# Altium project ErrorCodeDisplay.PrjPcb
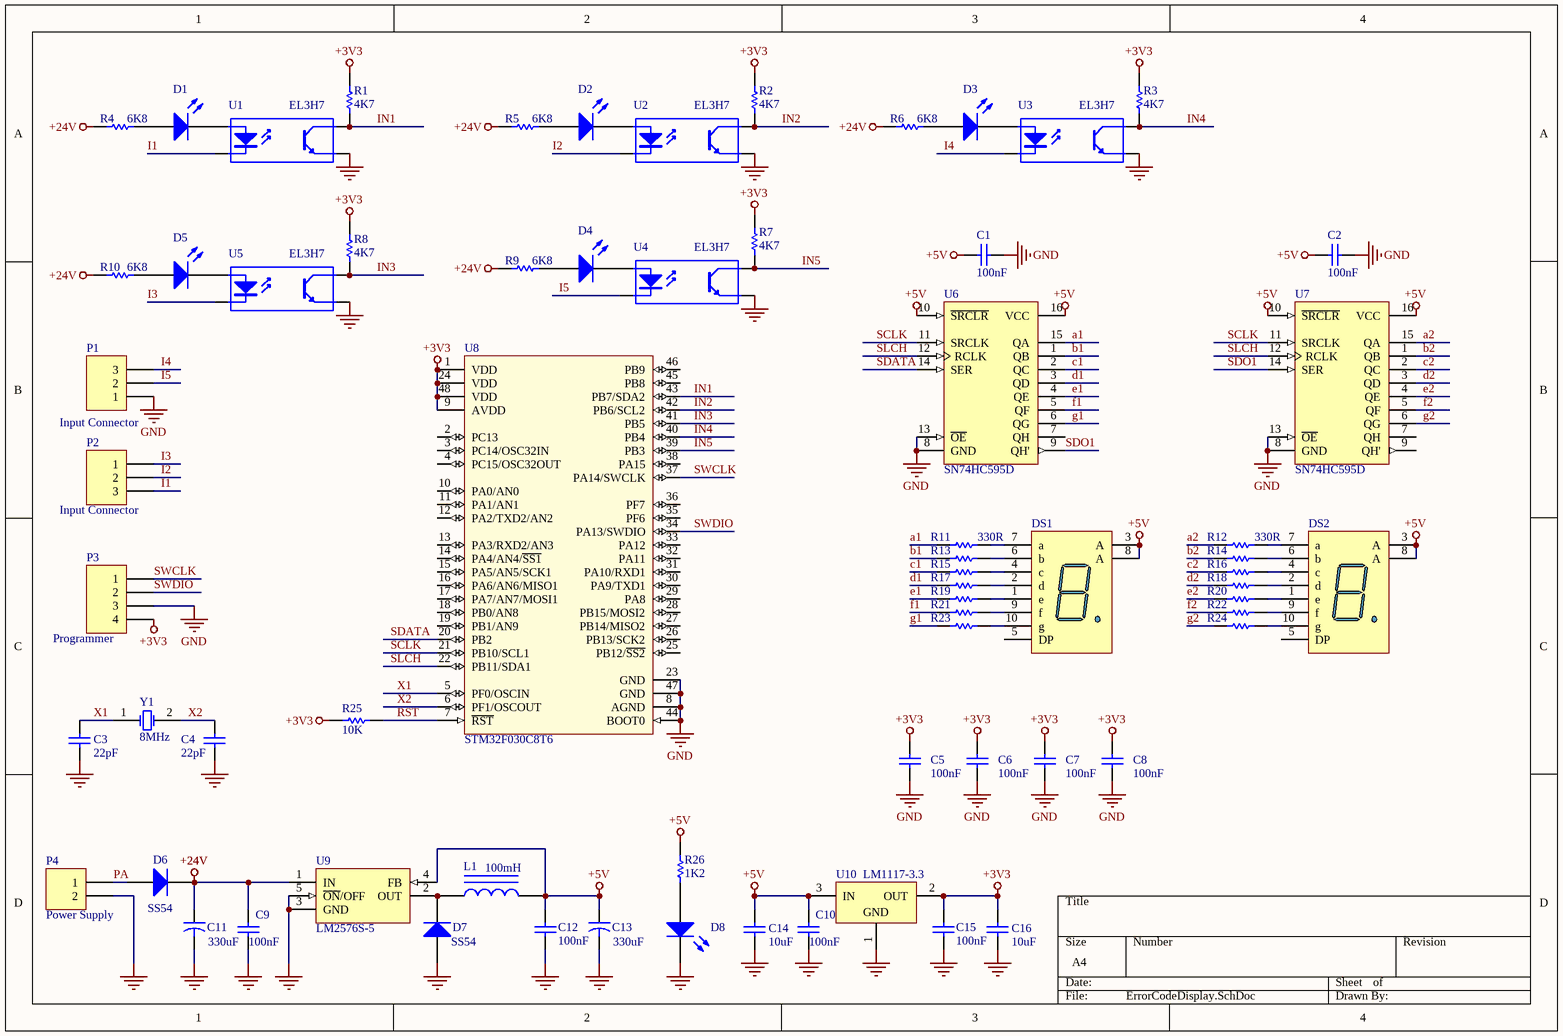
[diagram p0: ErrorCodeDisplay.SchDoc]
1 sheet, 68 parts. Net scope: global (net labels, ports and power ports of the same name join across sheets).
Board file: ErrorCodeDisplay.PcbDoc

## Sheet ErrorCodeDisplay.SchDoc
size A4

### Parts
C1  value 100nF  [C-0805]  (hidden comment: 104)
C2  value 100nF  [C-0805]  (hidden comment: 104)
C3  value 22pF  [C-0805]  (hidden comment: 22)
C4  value 22pF  [C-0805]  (hidden comment: 22)
C5  value 100nF  [C-0805]  (hidden comment: 104)
C6  value 100nF  [C-0805]  (hidden comment: 104)
C7  value 100nF  [C-0805]  (hidden comment: 104)
C8  value 100nF  [C-0805]  (hidden comment: 104)
C9  value 100nF  [C-0805]  (hidden comment: 104)
C10  value 100nF  [C-0805]  (hidden comment: 104)
C11  value 330uF  [C-ALU-10x10mm]  (hidden comment: 330uF/50V)
C12  value 100nF  [C-0805]  (hidden comment: 104)
C13  value 330uF  [C-ALU-10x10mm]  (hidden comment: 330uF/50V)
C14  value 10uF  [C-0805]  (hidden comment: 106)
C15  value 100nF  [C-0805]  (hidden comment: 104)
C16  value 10uF  [C-0805]  (hidden comment: 106)
D1  SMD0805-RED  [LED-0805]  (value not drawn)
D2  SMD0805-RED  [LED-0805]  (value not drawn)
D3  SMD0805-RED  [LED-0805]  (value not drawn)
D4  SMD0805-RED  [LED-0805]  (value not drawn)
D5  SMD0805-RED  [LED-0805]  (value not drawn)
D6  value SS54  [D-DO214-AB]  (hidden comment: S54-SMA)
D7  value SS54  [D-DO214-AB]  (hidden comment: SS54-SMA)
D8  SMD0805-RED  [LED-0805]  (value not drawn)
DS1  1Inch-CA-RED  [LED7-1.0inch]  (value not drawn)
DS2  1Inch-CA-RED  [LED7-1.0inch]  (value not drawn)
L1  value 100mH  [L-SMD-12.5x12.5]  (hidden comment: 100mH/3A)
P1  value Input Connector  [TER-KF128-3P]  (hidden comment: KF128-3P)
P2  value Input Connector  [TER-KF128-3P]  (hidden comment: KF128-3P)
P3  value Programmer  [JP2.54-M-1x04A]  (hidden comment: JP2.54-M-4P)
P4  value Power Supply  [TER-KF128-2P]  (hidden comment: KF128-2P)
R1  4K7  [R-0805]
R2  4K7  [R-0805]
R3  4K7  [R-0805]
R4  6K8  [R-0805]
R5  6K8  [R-0805]
R6  6K8  [R-0805]
R7  4K7  [R-0805]
R8  4K7  [R-0805]
R9  6K8  [R-0805]
R10  6K8  [R-0805]
R11  330R  [R-0805]
R12  330R  [R-0805]
R13  330R  [R-0805]  (value not drawn)
R14  330R  [R-0805]  (value not drawn)
R15  330R  [R-0805]  (value not drawn)
R16  330R  [R-0805]  (value not drawn)
R17  330R  [R-0805]  (value not drawn)
R18  330R  [R-0805]  (value not drawn)
R19  330R  [R-0805]  (value not drawn)
R20  330R  [R-0805]  (value not drawn)
R21  330R  [R-0805]  (value not drawn)
R22  330R  [R-0805]  (value not drawn)
R23  330R  [R-0805]  (value not drawn)
R24  330R  [R-0805]  (value not drawn)
R25  10K  [R-0805]
R26  1K2  [R-0805]
U1  EL3H7  [SSOP-4]
U2  EL3H7  [SSOP-4]
U3  EL3H7  [SSOP-4]
U4  EL3H7  [SSOP-4]
U5  EL3H7  [SSOP-4]
U6  SN74HC595D  [soic-16]
U7  SN74HC595D  [soic-16]
U8  STM32F030C8T6  [LQFP-48]
U9  LM2576S-5  [TO-263-5L]
U10  LM1117-3.3  [SOT-223-3]
Y1  8MHz  [XTAL-CSM7]

### Nets
+3V3: C5.1 C6.1 C7.1 C8.1 C15.1 C16.1 P3.4 R1.2 R2.2 R3.2 R7.2 R8.2 R25.2 U8.1(VDD) U8.9(AVDD) U8.24(VDD) U8.48(VDD) U10.2(OUT)
+5V: C1.1 C2.1 C10.1 C12.1 C13.1 C14.1 DS1.3(A) DS1.8(A) DS2.3(A) DS2.8(A) L1.2 R26.2 U6.10(~{SRCLR}) U6.16(VCC) U7.10(~{SRCLR}) U7.16(VCC) U9.4(FB) U10.3(IN)
+24V: C9.1 C11.1 D6.2(K) R4.1 R5.1 R6.1 R9.1 R10.1 U9.1(IN)
GND: C1.2 C2.2 C3.2 C4.2 C5.2 C6.2 C7.2 C8.2 C9.2 C10.2 C11.2 C12.2 C13.2 C14.2 C15.2 C16.2 D7.1(A) D8.2(K) P1.1 P3.3 P4.2 U1.3(E) U2.3(E) U3.3(E) U4.3(E) U5.3(E) U6.8(GND) U6.13(~{OE}) U7.8(GND) U7.13(~{OE}) U8.8(AGND) U8.23(GND) U8.44(BOOT0) U8.47(GND) U9.3(GND) U9.5(~{ON}/OFF) U9.HM U10.1(GND)
a1: R11.2 U6.15(QA)
a2: R12.2 U7.15(QA)
b1: R13.2 U6.1(QB)
b2: R14.2 U7.1(QB)
c1: R15.2 U6.2(QC)
c2: R16.2 U7.2(QC)
d1: R17.2 U6.3(QD)
d2: R18.2 U7.3(QD)
e1: R19.2 U6.4(QE)
e2: R20.2 U7.4(QE)
f1: R21.2 U6.5(QF)
f2: R22.2 U7.5(QF)
g1: R23.2 U6.6(QG)
g2: R24.2 U7.6(QG)
I1: P2.3 U1.2(K)
I2: P2.2 U2.2(K)
I3: P2.1 U5.2(K)
I4: P1.3 U3.2(K)
I5: P1.2 U4.2(K)
IN1: R1.1 U1.4(C) U8.43(PB7/SDA2)
IN2: R2.1 U2.4(C) U8.42(PB6/SCL2)
IN3: R8.1 U5.4(C) U8.41(PB5)
IN4: R3.1 U3.4(C) U8.40(PB4)
IN5: R7.1 U4.4(C) U8.39(PB3)
PA: D6.1(A) P4.1
RST: R25.1 U8.7(~{RST})
SCLK: U6.11(SRCLK) U7.11(SRCLK) U8.21(PB10/SCL1)
SDATA: U6.14(SER) U8.20(PB2)
SDO1: U6.9(QH') U7.14(SER)
SLCH: U6.12(RCLK) U7.12(RCLK) U8.22(PB11/SDA1)
SWCLK: P3.1 U8.37(PA14/SWCLK)
SWDIO: P3.2 U8.34(PA13/SWDIO)
X1: C3.1 U8.5(PF0/OSCIN) Y1.1(OSC1)
X2: C4.1 U8.6(PF1/OSCOUT) Y1.2(OSC2)
NetD1_1: D1.1(A) R4.2
NetD1_2: D1.2(K) U1.1(A)
NetD2_1: D2.1(A) R5.2
NetD2_2: D2.2(K) U2.1(A)
NetD3_1: D3.1(A) R6.2
NetD3_2: D3.2(K) U3.1(A)
NetD4_1: D4.1(A) R9.2
NetD4_2: D4.2(K) U4.1(A)
NetD5_1: D5.1(A) R10.2
NetD5_2: D5.2(K) U5.1(A)
NetD7_2: D7.2(K) L1.1 U9.2(OUT)
NetD8_1: D8.1(A) R26.1
NetDS1_1: DS1.1(e) R19.1
NetDS1_2: DS1.2(d) R17.1
NetDS1_4: DS1.4(c) R15.1
NetDS1_6: DS1.6(b) R13.1
NetDS1_7: DS1.7(a) R11.1
NetDS1_9: DS1.9(f) R21.1
NetDS1_10: DS1.10(g) R23.1
NetDS2_1: DS2.1(e) R20.1
NetDS2_2: DS2.2(d) R18.1
NetDS2_4: DS2.4(c) R16.1
NetDS2_6: DS2.6(b) R14.1
NetDS2_7: DS2.7(a) R12.1
NetDS2_9: DS2.9(f) R22.1
NetDS2_10: DS2.10(g) R24.1

Not connected (* = marked no-connect by the designer): DS1 5(DP); DS2 5(DP); U6 7(QH); U7 7(QH) 9(QH'); U8 2(PC13) 3(PC14/OSC32IN) 4(PC15/OSC32OUT) 10(PA0/AN0) 11(PA1/AN1) 12(PA2/TXD2/AN2) 13(PA3/RXD2/AN3) 14(PA4/AN4/~{SS1}) 15(PA5/AN5/SCK1) 16(PA6/AN6/MISO1) 17(PA7/AN7/MOSI1) 18(PB0/AN8) 19(PB1/AN9) 25(PB12/~{SS2}) 26(PB13/SCK2) 27(PB14/MISO2) 28(PB15/MOSI2) 29(PA8) 30(PA9/TXD1) 31(PA10/RXD1) 32(PA11) 33(PA12) 35(PF6) 36(PF7) 38(PA15) 45(PB8) 46(PB9)

### Library data of the parts
C1-C10 C12 C14-C16 = Cap: Capacitor; Published: 8-Jun-2000; LatestRevisionDate: 17-Jul-2002; LatestRevisionNote: Re-released for DXP Platform.; PackageReference: RAD-0.3; Publisher: Altium Limited
C11 C13 = Cap2: 100UF 50V 10x10.2MM; Published: 23-Sep-2002; PackageReference: CAPR5-4X5; Publisher: Altium Limited
D1-D5 = LED0: Typical INFRARED GaAs LED; Value: StatusLed; Published: 8-Jun-2000; LatestRevisionDate: 08-Jul-2005; LatestRevisionNote: Mech Layer 1 removed.; PackageReference: LED-0
D6 D7 = Diode 1N4004: 1 Amp General Purpose Rectifier; Published: 8-Jun-2000; LatestRevisionDate: 17-Jul-2002; LatestRevisionNote: Re-released for DXP Platform.; DatasheetDocument: 1998; PackageDocument: Aug-1999; PackageReference: DO-41; Code_JEDEC: DO-204-AL; ComponentLink1Description: Manufacturer Link; ComponentLink1URL: http://www.fairchildsemi.com/; ComponentLink2Description: Datasheet; ComponentLink2URL: http://www.fairchildsemi.com/ds/1N%2F1N4001.pdf
D8 = LED0: Typical INFRARED GaAs LED; Value: PowerLed; Published: 8-Jun-2000; LatestRevisionDate: 08-Jul-2005; LatestRevisionNote: Mech Layer 1 removed.; PackageReference: LED-0
DS1 DS2 = Dpy Blue-CA: 14.2 mm General Purpose Blue 7-Segment Display: CA, RH DP, Gray Surface; Value: 7SEG; MinimumIntensity: 2020 ucd; Note: IF = 10 mA; Published: 8-Jun-2000; LatestRevisionDate: 17-Dec-2003; LatestRevisionNote: Schematic revised, PCB Footprint replaced.; DatasheetVersion: 24-Sep-2002; PackageVersion: 24-Sep-2002; PackageReference: H; PackageDescription: LED, 7-Segment Display, 14.2 mm, RHD; 10 Leads; Row Space 15.24 mm; Pitch 2.54 mm; Colour: Blue; ComponentLink1Description: Manufacturer Link; ComponentLink1URL: http://www.agilent.com/
L1 = Inductor Iron: Magnetic-Core Inductor; Published: 24-Mar-1999; LatestRevisionDate: 17-Jul-2002; LatestRevisionNote: Re-released for DXP Platform.; PackageReference: AXIAL-0.9; Publisher: Altium Limited; PackageDescription: Axial Device, Thru-Hole; 2 Leads; 0.9 in Pin Spacing
P1 P2 = Header 3: Header, 3-Pin; LatestRevisionDate: 17-Jul-2002; LatestRevisionNote: Re-released for DXP Platform.
P3 = Header 4: Header, 4-Pin; LatestRevisionDate: 17-Jul-2002; LatestRevisionNote: Re-released for DXP Platform.
P4 = Header 2: Header, 2-Pin; LatestRevisionDate: 17-Jul-2002; LatestRevisionNote: Re-released for DXP Platform.
R1-R26 = Res1: Resistor; Published: 8-Jun-2000; LatestRevisionDate: 17-Jul-2002; LatestRevisionNote: Re-released for DXP Platform.; PackageReference: AXIAL-0.3; Publisher: Altium Limited; PackageDescription: Axial Device, Thru-Hole; 2 Leads; 0.3 in Pin Spacing
  R1-R3 R7 R8: Value: 4K7
  R4-R6 R9 R10: Value: 6K8
  R11-R24: Value: 330R
  R25: Value: 10K
  R26: Value: 1K2
U1-U5 = Optoisolator1: 4-Pin Phototransistor Optocoupler; Published: 24-Mar-1999; LatestRevisionDate: 04-Mar-2005; LatestRevisionNote: Sch pins 3 & 4 Swapped.; DatasheetDocument: Nov-2003; PackageReference: DIP-4; Value: EL3H7
U6 U7 = SN74HC595D: 8-Bit Shift Register with 3-State Output Registers; Published: 8-Jun-2000; LatestRevisionDate: 13-Apr-2006; LatestRevisionNote: IPC-7351 Footprint Added.; DatasheetVersion: May-1997; PackageVersion: Jan-1998; PackageReference: D016; Publisher: Altium Limited; PackageDescription: 16-Pin Small Outline Integrated Circuit 1.27 mm Pitch; Code_IPC: SOIC127P600-16; ComponentLink1Description: Manufacturer Link; ComponentLink1URL: http://www.ti.com/; ComponentLink2Description: Datasheet; ComponentLink2URL: http://www-s.ti.com/sc/ds/sn74hc595.pdf
U8 = STM32F030C8T6: ARM 32-bit Cortex-M0 CPU LQFP48; Value: STM32F030C8T6
U9 = LM2576S-5.0: Simple Switcher 3A Step Down Voltage Regulator; Note: Tab is connected to GND; Published: 15-Apr-2002; DatasheetVersion: Jun-1999; PackageReference: TS5B; Publisher: Altium Limited; PackageDescription: D2-PAK; 5 Leads; Body 14.4 (inc. leads) x 10.4 mm (LxW max); ComponentLink1Description: Manufacturer Link; ComponentLink1URL: http://www.national.com/; ComponentLink2Description: Datasheet; ComponentLink2URL: http://www.national.com/ds.cgi/LM/LM2576.pdf; ComponentLink3Description: URL Link1; ComponentLink3URL: http://www.national.com/pf/LM/LM2576.html
U10 = LM1117DT-3.3: 800mA Low-Dropout Linear Regulator, 3-pin TO-252; Manufacturer: National Semiconductor; PackageTopMarking: NSUZXYTT*LM1117*DT-3.3; PowerWise: N; CompType: LDO IC; Published: 4-Dec-2008; DatasheetVersion: Apr-2006; PackageVersion: revD, Feb-2009; PackageReference: TD03B; Publisher: Altium Limited; PackageDescription: TO252, Molded, Jedec, 6.8 x 6.10 x 2.30mm Body, 3 Lead, 2.28mm Pitch, Surface Mount; Supplier 1: Farnell; Supplier Part Number 1: 9486275; Supplier 2: Farnell; Supplier Part Number 2: 1523829; PartNumber: LM1117DT-3.3; RoHS: N; PinCount: 3; Code_JEDEC: TO-252-AA; ComponentLink1Description: LM1117 Datasheet; ComponentLink1URL: http://www.national.com/ds/LM/LM1117.pdf; ComponentLink2Description: LM1117 Web Page; ComponentLink2URL: http://www.national.com/pf/LM/LM1117.html; ComponentLink3Description: TD03B Package Page; ComponentLink3URL: http://www.national.com/packaging/folders/td03b.html; Value: LM1117-3.3
Y1 = XTAL: Crystal Oscillator 49S; Published: 8-Jun-2000; LatestRevisionDate: 17-Jul-2002; LatestRevisionNote: Re-released for DXP Platform.; PackageReference: R38; Value: 8MHz; PackageDescription: Crystal, Thru-Hole; 2 Leads; Body 3.1 x 8.2 mm (Dia.xH)